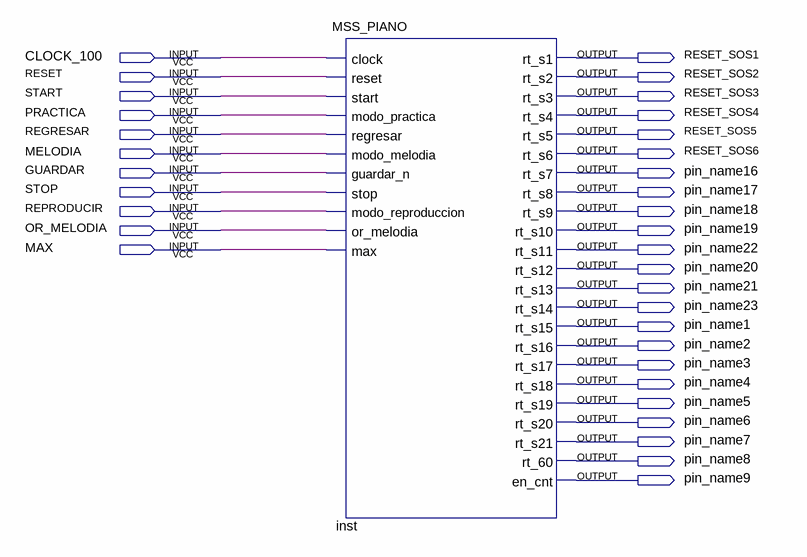
[diagram p0: schematic sheet]
// Quartus schematic MSS.bdf as structural Verilog: 1 symbols, 34 pins
module MSS (
  input  CLOCK_100,
  input  RESET,
  input  START,
  input  PRACTICA,
  input  REGRESAR,
  input  MELODIA,
  input  GUARDAR,
  input  STOP,
  input  REPRODUCIR,
  input  OR_MELODIA,
  input  MAX,
  output RESET_SOS1,
  output RESET_SOS2,
  output RESET_SOS3,
  output RESET_SOS4,
  output RESET_SOS5,
  output RESET_SOS6,
  output pin_name16,
  output pin_name17,
  output pin_name18,
  output pin_name19,
  output pin_name22,
  output pin_name20,
  output pin_name21,
  output pin_name23,
  output pin_name1,
  output pin_name2,
  output pin_name3,
  output pin_name4,
  output pin_name5,
  output pin_name6,
  output pin_name7,
  output pin_name8,
  output pin_name9
);

  MSS_PIANO inst (
    .clock(CLOCK_100), .reset(RESET), .start(START), .modo_practica(PRACTICA), .regresar(REGRESAR),
    .modo_melodia(MELODIA), .guardar_n(GUARDAR), .stop(STOP), .modo_reproduccion(REPRODUCIR),
    .or_melodia(OR_MELODIA), .max(MAX), .rt_s1(RESET_SOS1), .rt_s2(RESET_SOS2), .rt_s3(RESET_SOS3),
    .rt_s4(RESET_SOS4), .rt_s5(RESET_SOS5), .rt_s6(RESET_SOS6), .rt_s7(pin_name16), .rt_s8(pin_name17),
    .rt_s9(pin_name18), .rt_s10(pin_name19), .rt_s11(pin_name22), .rt_s12(pin_name20), .rt_s13(pin_name21),
    .rt_s14(pin_name23), .rt_s15(pin_name1), .rt_s16(pin_name2), .rt_s17(pin_name3), .rt_s18(pin_name4),
    .rt_s19(pin_name5), .rt_s20(pin_name6), .rt_s21(pin_name7), .rt_60(pin_name8), .en_cnt(pin_name9));
endmodule
